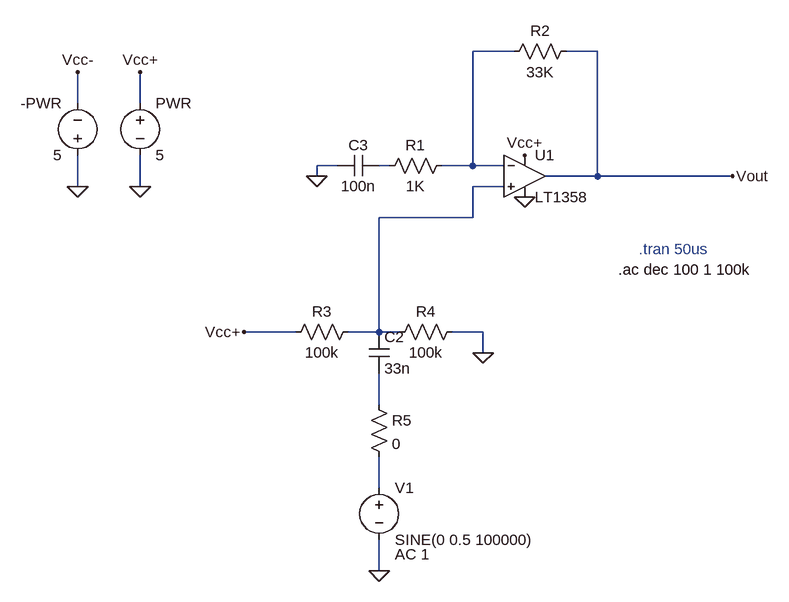
[diagram p0: schematic IQAmpkarenattempt.asc]
IQAmpkarenattempt.asc, the LTspice schematic file:
Version 4
SHEET 1 1244 912
WIRE 784 -128 720 -128
WIRE 912 -128 864 -128
WIRE 112 -48 112 -96
WIRE 208 -48 208 -96
WIRE 512 48 480 48
WIRE 592 48 576 48
WIRE 720 48 720 -128
WIRE 720 48 672 48
WIRE 768 48 720 48
WIRE 480 64 480 48
WIRE 912 64 912 -128
WIRE 912 64 832 64
WIRE 1120 64 912 64
WIRE 112 80 112 32
WIRE 208 80 208 32
WIRE 768 80 720 80
WIRE 720 128 720 80
WIRE 720 128 576 128
WIRE 448 304 368 304
WIRE 576 304 576 128
WIRE 576 304 528 304
WIRE 608 304 576 304
WIRE 736 304 688 304
WIRE 736 336 736 304
WIRE 576 416 576 368
WIRE 576 544 576 496
WIRE 576 672 576 624
FLAG 480 64 0
FLAG 208 -96 Vcc+
FLAG 800 32 Vcc+
FLAG 208 80 0
FLAG 112 80 0
FLAG 112 -96 Vcc-
FLAG 800 96 0
FLAG 368 304 Vcc+
FLAG 736 336 0
FLAG 576 672 0
FLAG 1120 64 Vout
SYMBOL Res 688 32 R90
WINDOW 0 0 56 VBottom 2
WINDOW 3 32 56 VTop 2
SYMATTR InstName R1
SYMATTR Value 1K
SYMBOL Voltage 208 -64 R0
SYMATTR InstName PWR
SYMATTR Value 5
SYMBOL OpAmps/LT1358 800 0 R0
SYMATTR InstName U1
SYMBOL Res 880 -144 R90
WINDOW 0 0 56 VBottom 2
WINDOW 3 32 56 VTop 2
SYMATTR InstName R2
SYMATTR Value 33K
SYMBOL Voltage 112 48 R180
WINDOW 0 24 96 Left 2
WINDOW 3 24 16 Left 2
SYMATTR InstName -PWR
SYMATTR Value 5
SYMBOL Res 544 288 R90
WINDOW 0 0 56 VBottom 2
WINDOW 3 32 56 VTop 2
SYMATTR InstName R3
SYMATTR Value 100k
SYMBOL Res 704 288 R90
WINDOW 0 0 56 VBottom 2
WINDOW 3 32 56 VTop 2
SYMATTR InstName R4
SYMATTR Value 100k
SYMBOL Cap 560 304 R0
SYMATTR InstName C2
SYMATTR Value 33n
SYMBOL Cap 576 32 R90
WINDOW 0 0 32 VBottom 2
WINDOW 3 32 32 VTop 2
SYMATTR InstName C3
SYMATTR Value 100n
SYMBOL Res 560 400 R0
SYMATTR InstName R5
SYMATTR Value 0
SYMBOL voltage 576 528 R0
WINDOW 123 24 118 Left 2
SYMATTR Value2 AC 1
SYMATTR InstName V1
SYMATTR Value SINE(0 0.5 100000)
TEXT 976 176 Left 2 ;.tran 50us
TEXT 944 208 Left 2 !.ac dec 100 1 100k

The netlist it stands for:
* IQAmpkarenattempt.asc
R1 N001 N002 1K
V§PWR Vcc+ 0 5
XU1 N003 N001 Vcc+ 0 Vout LT1357  ; LT1358, pins In+ In- V+ V- OUT
R2 Vout N001 33K
V§-PWR 0 Vcc- 5
R3 N003 Vcc+ 100k
R4 0 N003 100k
C2 N003 N004 33n
C3 N002 0 100n
R5 N004 N005 0
V1 N005 0 SINE(0 0.5 100000) AC 1
* .tran 50us
.ac dec 100 1 100k
.lib LTC.lib
.backanno
.end